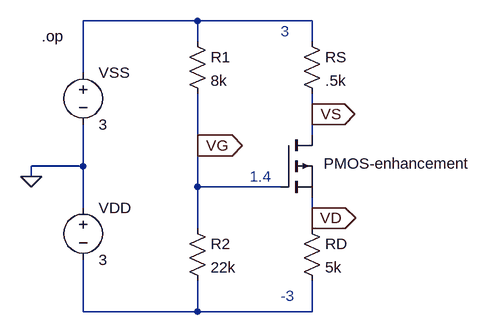
[diagram p0: schematic prob3_30.asc]
prob3_30.asc, the LTspice schematic file:
Version 4
SHEET 1 880 680
WIRE 256 -16 80 -16
WIRE 432 -16 256 -16
WIRE 256 16 256 -16
WIRE 432 16 432 -16
WIRE 80 64 80 -16
WIRE 432 128 432 96
WIRE 432 160 432 128
WIRE 256 176 256 96
WIRE 80 208 80 144
WIRE 80 208 0 208
WIRE 0 224 0 208
WIRE 256 240 256 176
WIRE 384 240 256 240
WIRE 80 272 80 208
WIRE 432 288 432 256
WIRE 256 304 256 240
WIRE 432 304 432 288
WIRE 80 432 80 352
WIRE 256 432 256 384
WIRE 256 432 80 432
WIRE 432 432 432 384
WIRE 432 432 256 432
FLAG 0 224 0
FLAG 256 176 VG
IOPIN 256 176 Out
FLAG 432 128 VS
IOPIN 432 128 Out
FLAG 432 288 VD
IOPIN 432 288 Out
SYMBOL pmos 384 160 R0
WINDOW 0 66 44 Left 2
SYMATTR InstName PMOS-enhancement
SYMATTR Value ""
SYMBOL voltage 80 48 R0
SYMATTR InstName VSS
SYMATTR Value 3
SYMBOL voltage 80 256 R0
SYMATTR InstName VDD
SYMATTR Value 3
SYMBOL res 240 0 R0
SYMATTR InstName R1
SYMATTR Value 8k
SYMBOL res 240 288 R0
SYMATTR InstName R2
SYMATTR Value 22k
SYMBOL res 416 0 R0
SYMATTR InstName RS
SYMATTR Value .5k
SYMBOL res 416 288 R0
SYMATTR InstName RD
SYMATTR Value 5k
TEXT 16 8 Left 2 !.op
TEXT 336 224 Left 2 ;1.4
TEXT 384 0 Left 2 ;3
TEXT 384 408 Left 2 ;-3

The netlist it stands for:
* prob3_30.asc
M§PMOS-enhancement VS VG VD VD
VSS N001 0 3
VDD 0 N002 3
R1 N001 VG 8k
R2 VG N002 22k
RS N001 VS .5k
RD VD N002 5k
.model NMOS NMOS
.model PMOS PMOS
.lib standard.mos
.op
* 1.4
* 3
* -3
.backanno
.end